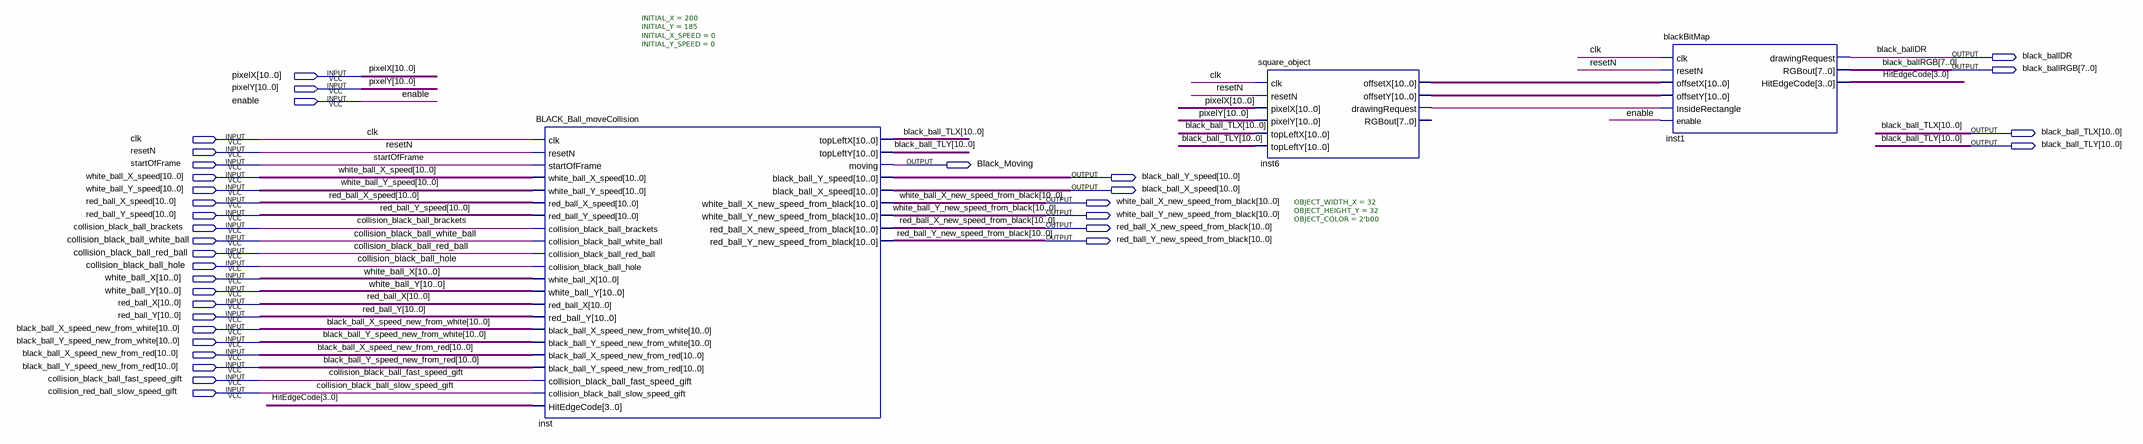
[diagram p0: schematic sheet]
// Quartus schematic Black_ball_block.bdf as structural Verilog: 3 symbols, 35 pins
module Black_ball_block (
  input  [10:0] pixelX,
  input  [10:0] pixelY,
  input  enable,
  input  clk,
  input  resetN,
  input  startOfFrame,
  input  [10:0] white_ball_X_speed,
  input  [10:0] white_ball_Y_speed,
  input  [10:0] red_ball_X_speed,
  input  [10:0] red_ball_Y_speed,
  input  collision_black_ball_brackets,
  input  collision_black_ball_white_ball,
  input  collision_black_ball_red_ball,
  input  collision_black_ball_hole,
  input  [10:0] white_ball_X,
  input  [10:0] white_ball_Y,
  input  [10:0] red_ball_X,
  input  [10:0] red_ball_Y,
  input  [10:0] black_ball_X_speed_new_from_white,
  input  [10:0] black_ball_Y_speed_new_from_white,
  input  [10:0] black_ball_X_speed_new_from_red,
  input  [10:0] black_ball_Y_speed_new_from_red,
  input  collision_black_ball_fast_speed_gift,
  input  collision_red_ball_slow_speed_gift,
  output black_ballDR,
  output [7:0] black_ballRGB,
  output [10:0] black_ball_TLX,
  output [10:0] black_ball_TLY,
  output Black_Moving,
  output [10:0] black_ball_Y_speed,
  output [10:0] black_ball_X_speed,
  output [10:0] white_ball_X_new_speed_from_black,
  output [10:0] white_ball_Y_new_speed_from_black,
  output [10:0] red_ball_X_new_speed_from_black,
  output [10:0] red_ball_Y_new_speed_from_black
);

  wire inst6_drawingrequest;
  wire [3:0] HitEdgeCode;
  wire [10:0] inst6_offsetx, inst6_offsety;

  BLACK_Ball_moveCollision #(.INITIAL_X(200), .INITIAL_Y(185), .INITIAL_X_SPEED(0), .INITIAL_Y_SPEED(0)) inst (
    .clk(clk), .resetN(resetN), .startOfFrame(startOfFrame), .white_ball_X_speed(white_ball_X_speed),
    .white_ball_Y_speed(white_ball_Y_speed), .red_ball_X_speed(red_ball_X_speed),
    .red_ball_Y_speed(red_ball_Y_speed), .collision_black_ball_brackets(collision_black_ball_brackets),
    .collision_black_ball_white_ball(collision_black_ball_white_ball),
    .collision_black_ball_red_ball(collision_black_ball_red_ball),
    .collision_black_ball_hole(collision_black_ball_hole), .white_ball_X(white_ball_X),
    .white_ball_Y(white_ball_Y), .red_ball_X(red_ball_X), .red_ball_Y(red_ball_Y),
    .black_ball_X_speed_new_from_white(black_ball_X_speed_new_from_white),
    .black_ball_Y_speed_new_from_white(black_ball_Y_speed_new_from_white),
    .black_ball_X_speed_new_from_red(black_ball_X_speed_new_from_red),
    .black_ball_Y_speed_new_from_red(black_ball_Y_speed_new_from_red),
    .collision_black_ball_fast_speed_gift(collision_black_ball_fast_speed_gift),
    .collision_black_ball_slow_speed_gift(collision_red_ball_slow_speed_gift), .HitEdgeCode(HitEdgeCode),
    .topLeftX(black_ball_TLX), .topLeftY(black_ball_TLY), .moving(Black_Moving),
    .black_ball_Y_speed(black_ball_Y_speed), .black_ball_X_speed(black_ball_X_speed),
    .white_ball_X_new_speed_from_black(white_ball_X_new_speed_from_black),
    .white_ball_Y_new_speed_from_black(white_ball_Y_new_speed_from_black),
    .red_ball_X_new_speed_from_black(red_ball_X_new_speed_from_black),
    .red_ball_Y_new_speed_from_black(red_ball_Y_new_speed_from_black));
  square_object #(.OBJECT_WIDTH_X(32), .OBJECT_HEIGHT_Y(32), .OBJECT_COLOR(2'b00)) inst6 (
    .clk(clk), .resetN(resetN), .pixelX(pixelX), .pixelY(pixelY), .topLeftX(black_ball_TLX),
    .topLeftY(black_ball_TLY), .offsetX(inst6_offsetx), .offsetY(inst6_offsety),
    .drawingRequest(inst6_drawingrequest));  // open: RGBout
  blackBitMap inst1 (
    .clk(clk), .resetN(resetN), .offsetX(inst6_offsetx), .offsetY(inst6_offsety),
    .InsideRectangle(inst6_drawingrequest), .enable(enable), .drawingRequest(black_ballDR),
    .RGBout(black_ballRGB), .HitEdgeCode(HitEdgeCode));

  // Other names for the same wires on the sheet: collision_black_ball_slow_speed_gift = collision_red_ball_slow_speed_gift
endmodule
